# Altium schematic sheet Cover.SchDoc
size A0
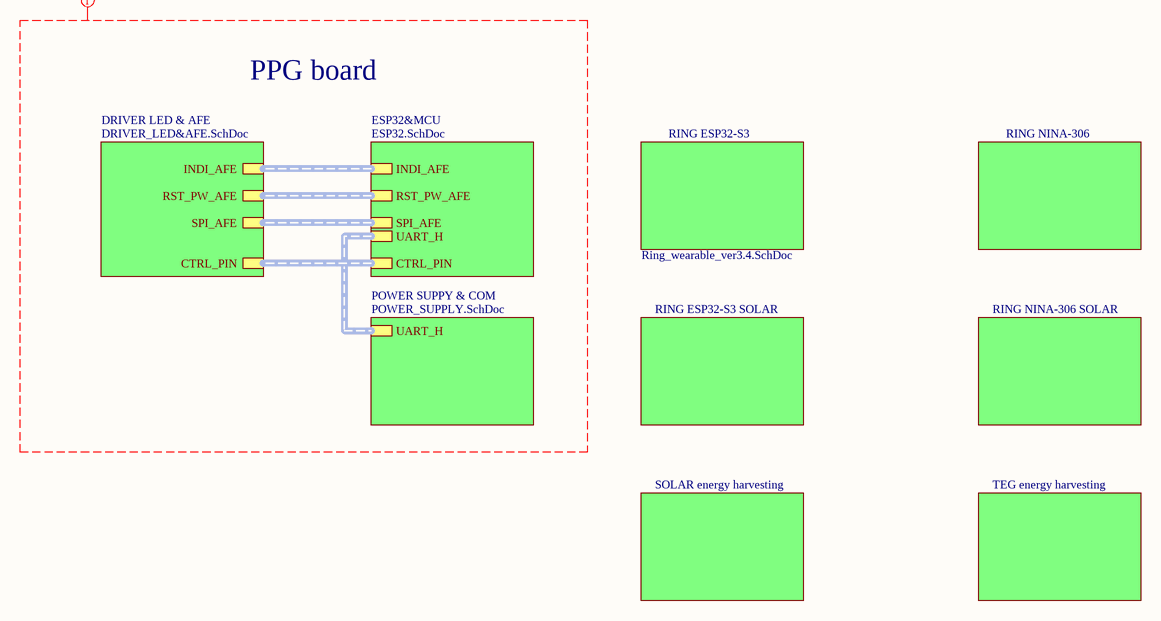
[diagram p0: Cover.SchDoc]

## Sub-sheets
DRIVER LED & AFE = DRIVER_LED&AFE.SchDoc: SPI_AFE (harness SPI_AFE), RST_PW_AFE (harness RST_PW_AFE), INDI_AFE (harness INDI_AFE), CTRL_PIN (harness CTRL_PIN)
ESP32&MCU = ESP32.SchDoc: UART_H (harness UART_H), SPI_AFE (harness SPI_AFE), RST_PW_AFE (harness RST_PW_AFE), INDI_AFE (harness INDI_AFE), CTRL_PIN (harness SPI_AFE)
POWER SUPPY & COM = POWER_SUPPLY.SchDoc: UART_H (harness UART_H)
RING ESP32-S3  = Ring_wearable_ver3.4.SchDoc: no entries
RING ESP32-S3 SOLAR   = ?: no entries
RING NINA-306  = ?: no entries
RING NINA-306 SOLAR   = ?: no entries
SOLAR energy harvesting = ?: no entries
TEG energy harvesting = ?: no entries

## Buses and harness runs
harness sheet DRIVER LED & AFE/CTRL_PIN = sheet ESP32&MCU/CTRL_PIN
harness sheet DRIVER LED & AFE/INDI_AFE = sheet ESP32&MCU/INDI_AFE
harness sheet DRIVER LED & AFE/RST_PW_AFE = sheet ESP32&MCU/RST_PW_AFE
harness sheet DRIVER LED & AFE/SPI_AFE = sheet ESP32&MCU/SPI_AFE
harness sheet ESP32&MCU/UART_H = sheet POWER SUPPY & COM/UART_H

## Layout directives
net class PPG board: (no net found under the mark)

## Notes on the sheet
- PPG board